# Altium schematic sheet EFR32xG22_ESL-Node_Ref-Des_Sheet2.SchDoc: LED, NTAG, EPD, XM, Batteries
size A3; Organization: Altium Limited; Revision: A02; SheetNumber: 2; SheetTotal: 2
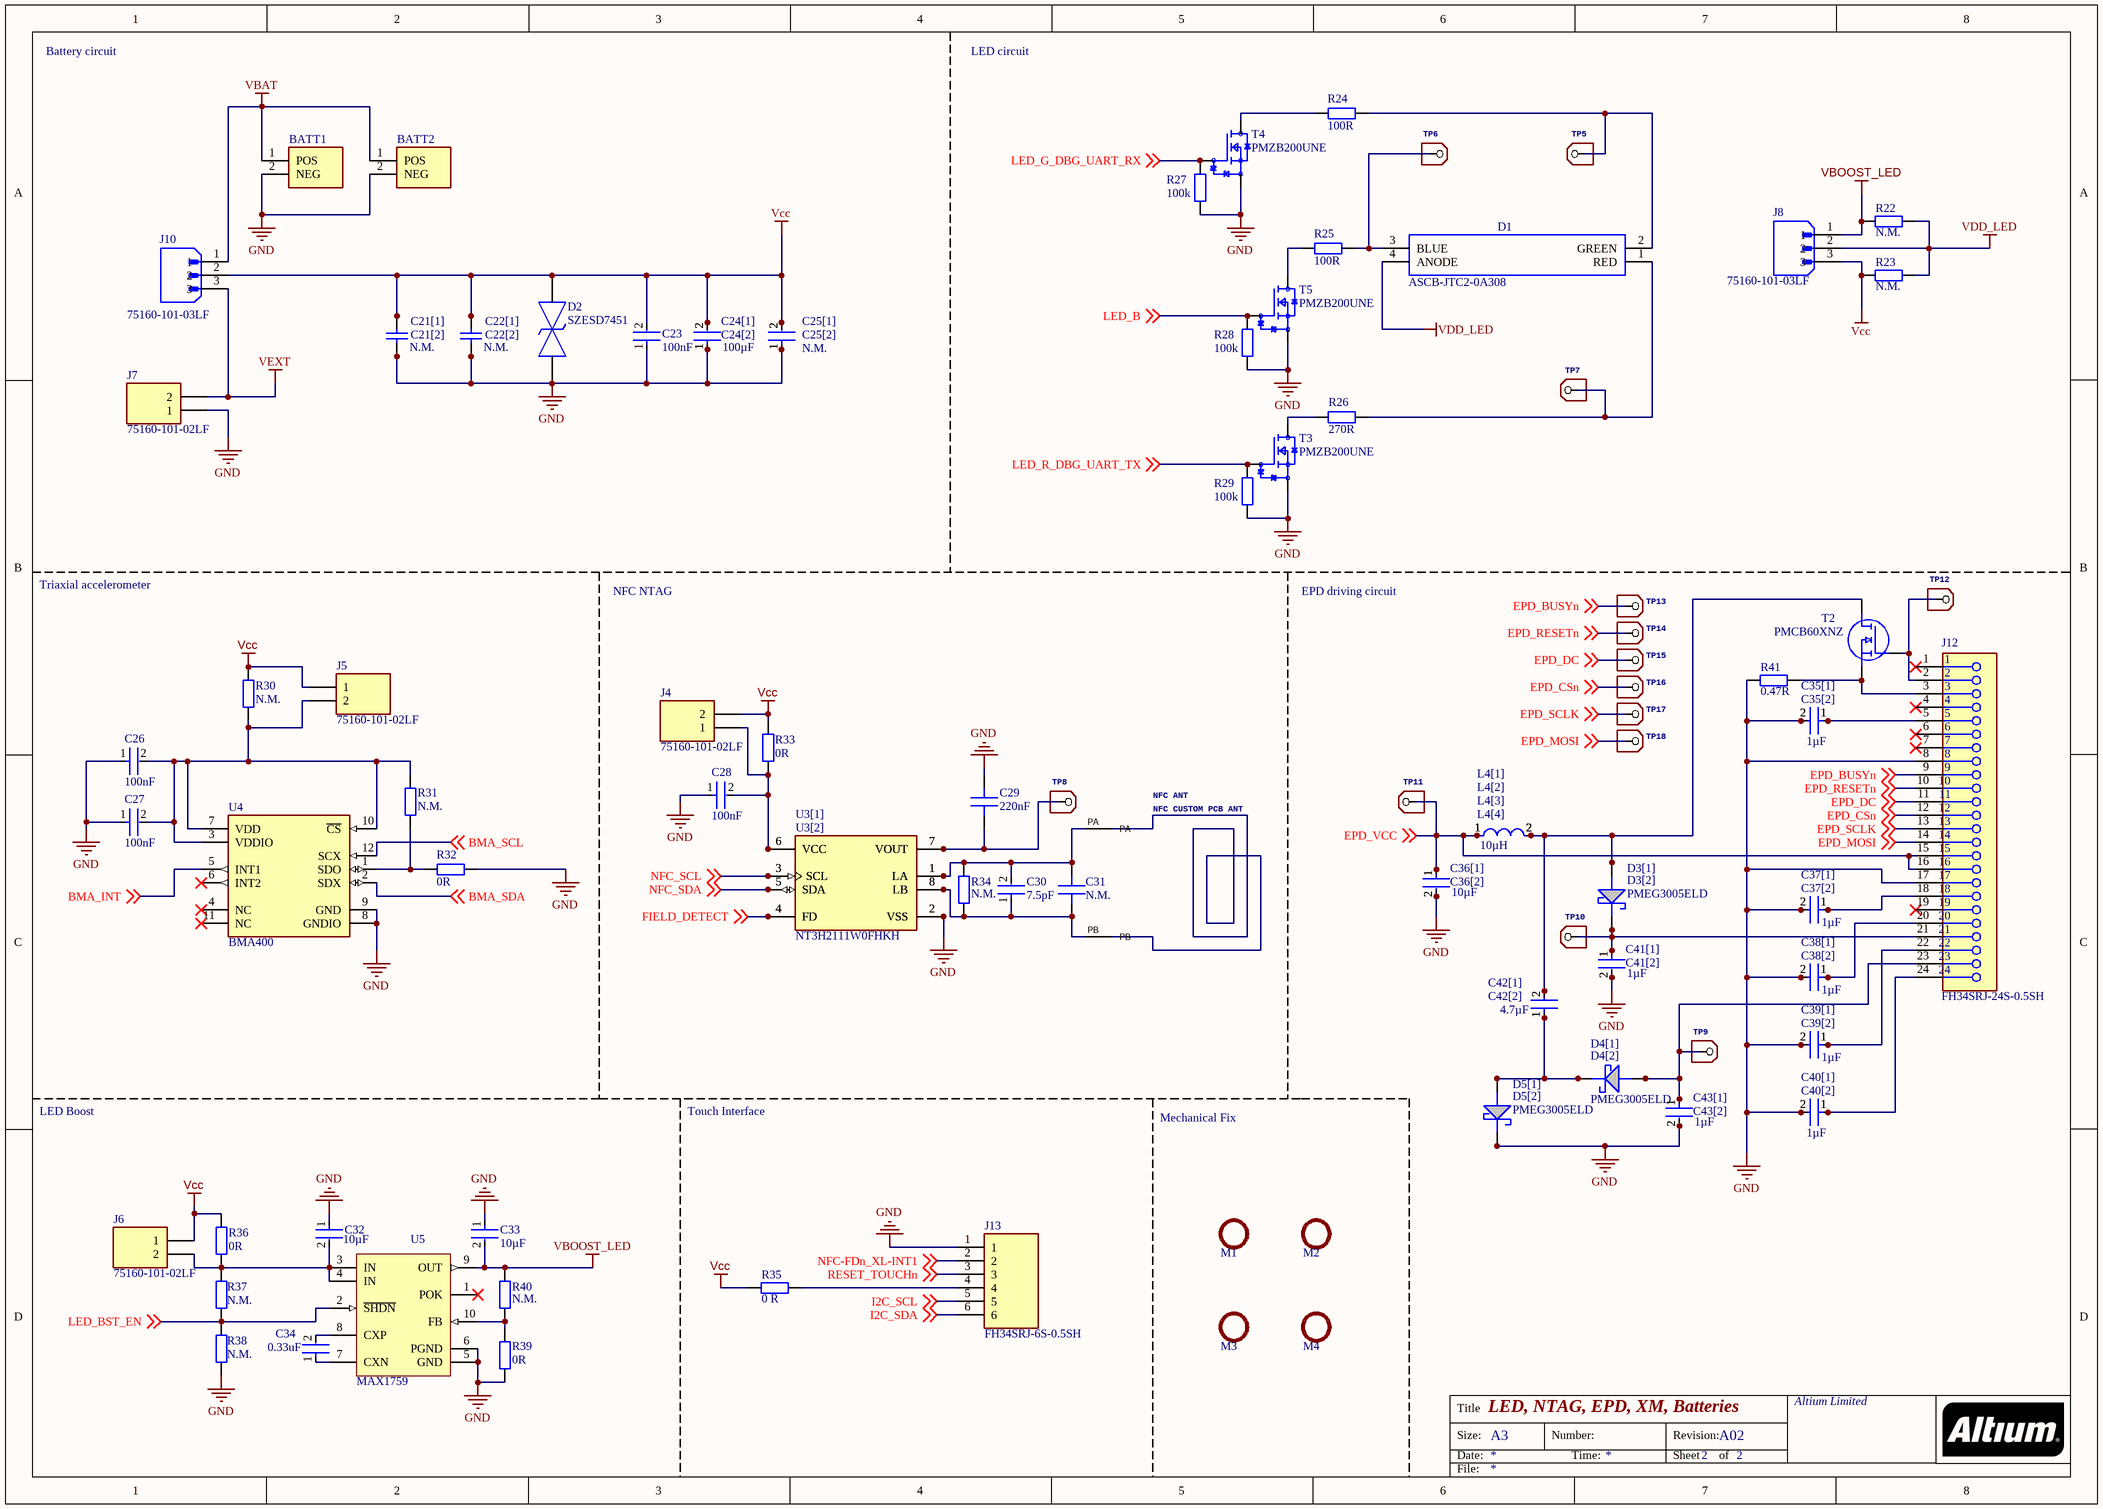
[diagram p0: EFR32xG22_ESL-Node_Ref-Des_Sheet2.SchDoc]

## Parts
BATT1  1052TR  [Battery_holder_CR2450_SMT_1052]  (value not drawn)
BATT2  1052TR  [Battery_holder_CR2450_SMT_1052]  (value not drawn)
C21[1]  N.M.  [1206]
C21[2]  N.M.  [0805]  (value not drawn)
C22[1]  N.M.  [1206]
C22[2]  N.M.  [0805]  (value not drawn)
C23  100nF  [0402]
C24[1]  100µF  [1206]
C24[2]  100µF  [0805]  (value not drawn)
C25[1]  N.M.  [1206]
C25[2]  100µF  [0805]  (value not drawn)
C26  100nF  [0402]
C27  100nF  [0402]
C28  100nF  [0201]
C29  value 220nF  [0201]  (hidden comment: CAP CER 1000PF 10V X7R 0201 10%)
C30  7.5pF  [0201]
C31  value N.M.  [0201]  (hidden comment: CAP CER 0201 C0G 1.2pF 50V 0.05pF)
C32  10µF  [0603]
C33  10µF  [0603]
C34  0.33uF  [0603]
C35[1]  1µF  [0603]
C35[2]  1µF  [0402]  (value not drawn)
C36[1]  10µF  [0603]
C36[2]  10µF  [0402]  (value not drawn)
C37[1]  1µF  [0603]
C37[2]  1µF  [0402]  (value not drawn)
C38[1]  1µF  [0603]
C38[2]  1µF  [0402]  (value not drawn)
C39[1]  1µF  [0603]
C39[2]  1µF  [0402]  (value not drawn)
C40[1]  1µF  [0603]
C40[2]  1µF  [0402]  (value not drawn)
C41[1]  1µF  [0603]
C41[2]  1µF  [0402]  (value not drawn)
C42[1]  4.7µF  [0603]
C42[2]  4.7µF  [0402]  (value not drawn)
C43[1]  1µF  [0603]
C43[2]  1µF  [0402]  (value not drawn)
D1  ASCB-JTC2-0A308  [LED_RGB_PLCC-4]
D2  SZESD7451  [SOD882_NXP]
D3[1]  PMEG3005ELD  [SOD-323]  (value not drawn)
D3[2]  PMEG3005ELD  [SOD882_FIXED]
D4[1]  PMEG3005ELD  [SOD-323]  (value not drawn)
D4[2]  PMEG3005ELD  [SOD882_FIXED]
D5[1]  PMEG3005ELD  [SOD-323]  (value not drawn)
D5[2]  PMEG3005ELD  [SOD882_FIXED]
J4  75160-101-02LF  [Jumper_HDR_2.54mm]
J5  75160-101-02LF  [Jumper_HDR_2.54mm]
J6  75160-101-02LF  [Jumper_HDR_2.54mm]
J7  75160-101-02LF  [Jumper_HDR_2.54mm]
J8  75160-101-03LF  [Jumper_HDR_2.54mm_3p]
J10  75160-101-03LF  [Jumper_HDR_2.54mm_3p]
J12  FH34SRJ-24S-0.5SH  [FPC_CONNECTOR_24_0.5MM_PITCH_BOTTOM_CONTACT_ACES_1.3MM_50530]
J13  FH34SRJ-6S-0.5SH  [FH34SRJ-6S-0.5SH]
L4[1]  10µH  [0805]  (value not drawn)
L4[2]  10µH  [0806]  (value not drawn)
L4[3]  10µH  [2520]  (value not drawn)
L4[4]  10µH  [WE-MAPI-3015]
M1  HOLE_2.2_NPL  [HOLE_2.2_NPL]  (value not drawn)
M2  HOLE_2.2_NPL  [HOLE_2.2_NPL]  (value not drawn)
M3  HOLE_2.2_NPL  [HOLE_2.2_NPL]  (value not drawn)
M4  HOLE_2.2_NPL  [HOLE_2.2_NPL]  (value not drawn)
NFC_ANT  NFC CUSTOM PCB ANT  [NFC_27X14.3_7W_WIDTH0.25MM_SPACE0.2MM_1.5UH_V1_0_NOVIASTOP]
R22  N.M.  [0603]
R23  N.M.  [0603]
R24  value 100R  [0201]  (hidden comment: RES 0201 100R 1/20W 1% 200ppm)
R25  value 100R  [0201]  (hidden comment: RES 0201 100R 1/20W 1% 200ppm)
R26  270R  [0201]
R27  100k  [0201]
R28  100k  [0201]
R29  100k  [0201]
R30  N.M.  [0603]
R31  value N.M.  [0201]  (hidden comment: RES 0201 0R)
R32  value 0R  [0201]  (hidden comment: RES 0201 0R)
R33  0R  [0603]
R34  value N.M.  [0201]  (hidden comment: RES 0201 0R)
R35  0 R  [0603]
R36  0R  [0603]
R37  N.M.  [0603]
R38  N.M.  [0603]
R39  value 0R  [0201]  (hidden comment: RES 0201 0R)
R40  value N.M.  [0201]  (hidden comment: RES 0201 0R)
R41  0.47R  [0402]
T2  PMCB60XNZ  [SOT8026]
T3  PMZB200UNE  [SOT883_B_FIXED]
T4  PMZB200UNE  [SOT883_B_FIXED]
T5  PMZB200UNE  [SOT883_B_FIXED]
TP5  TPSMDR1  [TP_RPAD1]  (value not drawn)
TP6  TPSMDR1  [TP_RPAD1]  (value not drawn)
TP7  TPSMDR1  [TP_RPAD1]  (value not drawn)
TP8  TPSMDR1  [TP_RPAD1]  (value not drawn)
TP9  TPSMDR1  [TP_RPAD1]  (value not drawn)
TP10  TPSMDR1  [TP_RPAD1]  (value not drawn)
TP11  TPSMDR1  [TP_RPAD1]  (value not drawn)
TP12  TPSMDR1  [TP_RPAD1]  (value not drawn)
TP13  TPSMDR1  [TP_RPAD1]  (value not drawn)
TP14  TPSMDR1  [TP_RPAD1]  (value not drawn)
TP15  TPSMDR1  [TP_RPAD1]  (value not drawn)
TP16  TPSMDR1  [TP_RPAD1]  (value not drawn)
TP17  TPSMDR1  [TP_RPAD1]  (value not drawn)
TP18  TPSMDR1  [TP_RPAD1]  (value not drawn)
U3[1]  NT3H2111W0FHKH  [SO8_SOIC127P600X175-8N]  (value not drawn)
U3[2]  NT3H2111W0FHKH  [XQFN-8]
U4  BMA400  [BMA400]
U5  MAX1759  [UMAX10]

## Nets
GND: BATT1.2(NEG) BATT2.2(NEG) C21[1].1 C21[2].1 C22[1].1 C22[2].1 C23.1 C24[1].1 C24[2].1 C25[1].1 C25[2].1 C26.1 C27.1 C28.1 C29.1 C32.1 C33.1 C35[1].2 C35[2].2 C36[1].2 C36[2].2 C37[1].2 C37[2].2 C38[1].2 C38[2].2 C39[1].2 C39[2].2 C40[1].2 C40[2].2 C41[1].2 C41[2].2 C43[1].2 C43[2].2 D2.A D5[1].C D5[2].C J7.1 J12.8 J12.17 J13.1 R27.1 R28.1 R29.1 R32.1 R38.1 R39.1 R41.2 T3.S T4.S T5.S U3[1].2(VSS) U3[2].2(VSS) U4.8(GNDIO) U4.9(GND) U5.5(GND) U5.6(PGND)
VBAT: BATT1.1(POS) BATT2.1(POS) J10.1
VBOOST_LED: C33.2 J8.1 R22.2 R40.2 U5.9(OUT)
Vcc: C21[1].2 C21[2].2 C22[1].2 C22[2].2 C23.2 C24[1].2 C24[2].2 C25[1].2 C25[2].2 D2.C J4.2 J5.1 J6.1 J8.3 J10.2 R23.2 R30.2 R33.2 R35.2 R36.2
VDD_LED: D1.4(ANODE) J8.2 R22.1 R23.1
VEXT: J7.2 J10.3
BMA_INT: U4.5(INT1) ; off-sheet BMA_INT
BMA_SCL: U4.12(SCX) ; off-sheet BMA_SCL
BMA_SDA: U4.2(SDX) ; off-sheet BMA_SDA
EPD_BUSYn: J12.9 TP13.P$1 ; off-sheet EPD_BUSYn
EPD_CSn: J12.12 TP16.P$1 ; off-sheet EPD_CSn
EPD_DC: J12.11 TP15.P$1 ; off-sheet EPD_DC
EPD_MOSI: J12.14 TP18.P$1 ; off-sheet EPD_MOSI
EPD_RESETn: J12.10 TP14.P$1 ; off-sheet EPD_RESETn
EPD_SCLK: J12.13 TP17.P$1 ; off-sheet EPD_SCLK
EPD_VCC: C36[1].1 C36[2].1 J12.15 J12.16 L4[1].1 L4[2].1 L4[3].1 L4[4].1 TP11.P$1 ; off-sheet EPD_VCC
FIELD_DETECT: U3[1].4(FD) U3[2].4(FD) ; off-sheet FIELD_DETECT
I2C_SCL: J13.5 ; off-sheet I2C_SCL
I2C_SDA: J13.6 ; off-sheet I2C_SDA
LED_B: R28.2 T5.G ; off-sheet LED_B
LED_BST_EN: R37.1 R38.2 U5.2(~{SHDN}) ; off-sheet LED_BST_EN
LED_G_DBG_UART_RX: R27.2 T4.G ; off-sheet LED_G_DBG_UART_RX
LED_R_DBG_UART_TX: R29.2 T3.G ; off-sheet LED_R_DBG_UART_TX
NFC-FDn_XL-INT1: J13.2 ; off-sheet NFC-FDn_XL-INT1
NFC_SCL: U3[1].3(SCL) U3[2].3(SCL) ; off-sheet NFC_SCL
NFC_SDA: U3[1].5(SDA) U3[2].5(SDA) ; off-sheet NFC_SDA
RESET_TOUCHn: J13.3 ; off-sheet RESET_TOUCHn
NetC26_2: C26.2 C27.2 J5.2 R30.1 R31.1 U4.3(VDDIO) U4.7(VDD) U4.10(~{CS})
NetC28_2: C28.2 J4.1 R33.1 U3[1].6(VCC) U3[2].6(VCC)
NetC29_2: C29.2 TP8.P$1 U3[1].7(VOUT) U3[2].7(VOUT)
NetC30_1: C30.1 C31.1 NFC_ANT.PB R34.1 U3[1].8(LB) U3[2].8(LB)
NetC30_2: C30.2 C31.2 NFC_ANT.PA R34.2 U3[1].1(LA) U3[2].1(LA)
NetC32_2: C32.2 J6.2 R36.1 R37.2 U5.3(IN) U5.4(IN)
NetC34_1: C34.1 U5.7(CXN)
NetC34_2: C34.2 U5.8(CXP)
NetC35[1]_1: C35[1].1 C35[2].1 J12.5
NetC37[1]_1: C37[1].1 C37[2].1 J12.18
NetC38[1]_1: C38[1].1 C38[2].1 J12.20
NetC39[1]_1: C39[1].1 C39[2].1 J12.22
NetC40[1]_1: C40[1].1 C40[2].1 J12.24
NetC41[1]_1: C41[1].1 C41[2].1 D3[1].C D3[2].C J12.21 TP10.P$1
NetC42[1]_1: C42[1].1 C42[2].1 D4[1].C D4[2].C D5[1].A D5[2].A
NetC42[1]_2: C42[1].2 C42[2].2 D3[1].A D3[2].A L4[1].2 L4[2].2 L4[3].2 L4[4].2 T2.D
NetC43[1]_1: C43[1].1 C43[2].1 D4[1].A D4[2].A J12.23 TP9.P$1
NetD1_1: D1.1(RED) R26.2 TP7.P$1
NetD1_2: D1.2(GREEN) R24.2 TP5.P$1
NetD1_3: D1.3(BLUE) R25.2 TP6.P$1
NetJ12_2: J12.2 T2.G TP12.P$1
NetJ12_3: J12.3 R41.1 T2.S
NetJ13_4: J13.4 R35.1
NetR24_1: R24.1 T4.D
NetR25_1: R25.1 T5.D
NetR26_1: R26.1 T3.D
NetR31_2: R31.2 R32.2 U4.1(SDO)
NetR39_2: R39.2 R40.1 U5.10(FB)

Not connected (* = marked no-connect by the designer): J12 1* 4* 6* 7* 19*; M1 0; M2 0; M3 0; M4 0; U4 4(NC)* 6(INT2)* 11(NC)*; U5 1(POK)*

## Notes on the sheet
- Battery circuit
- LED circuit
- Triaxial accelerometer
- NFC NTAG
- EPD driving circuit
- LED Boost
- Touch Interface
- Mechanical Fix
- Title
- Size:
- Date:
- A3
- Number:
- Time:
- Revision:
- Sheet
- of
- File:

## Library data of the parts
BATT1 BATT2 = 1052TR: Battery Holder _Open_ Coin, 24.5mm 1 Cell SMD _SMT_ Tab; MF: Keystone Electronics; Availability: Unavailable; SnapEDA_Link: https://www.snapeda.com/parts/1052TR/Keystone%20Electronics/view-part/3611881/?ref=snap; MP: 1052TR; Price: None; Package: None; Value: *
C21[1] C22[1] = CMP-1662-00011-2: Chip Capacitor, 100 uF, +/- 20%, 6.3 V, -55 to 85 degC, 1206 (3216 Metric), RoHS, Tape and Reel; PartNumber: GRM31CR60J107ME39L; Capacitance: 100 uF; Voltage Rating (DC): 6.3 V; Type (Capacitors): X5R; REACH SVHC: No SVHC; Height: 1.6 mm; Tolerance: 20%; Packaging: Tape and Reel; Mount: Surface Mount; PackageDescription: 2-Pin Surface Mount Device, Body 3.2 x 1.6 mm; ComponentLink1URL: http://www.murata.com/; Case\/Package: 1206; Pins: 2; ComponentLink2Description: Datasheet; PackageReference: 1206; Width: 1.6 mm; Package Quantity: 2000; Min Operating Temperature: -55 degC; Case Code (Imperial): 1206; Max Operating Temperature: 85 degC; DatasheetVersion: 09/2016; Mounting Technology: Surface Mount; Voltage Rating: 6.3 V; ComponentLink1Description: Manufacturer URL; Radiation Hardening: No; Case Code (Metric): 3216; Length: 3.2 mm; ComponentLink2URL: http://psearch.en.murata.com/capacitor/product/GRM31CR60J107ME39%23.pdf; RoHSCompliant: true
C21[2] C22[2] = CMP-1662-00011-2: Chip Capacitor, 100 uF, +/- 20%, 6.3 V, -55 to 85 degC, 1206 (3216 Metric), RoHS, Tape and Reel; PartNumber: GRM31CR60J107ME39L; Case\/Package: 1206; Capacitance: 100 uF; Voltage Rating (DC): 6.3 V; Type (Capacitors): X5R; REACH SVHC: No SVHC; Height: 1.6 mm; Tolerance: 20%; Packaging: Tape and Reel; Mount: Surface Mount; PackageDescription: 2-Pin Surface Mount Device, Body 3.2 x 1.6 mm; ComponentLink1URL: http://www.murata.com/; Pins: 2; ComponentLink2Description: Datasheet; PackageReference: 1206; Width: 1.6 mm; Package Quantity: 2000; Min Operating Temperature: -55 degC; Case Code (Imperial): 1206; Max Operating Temperature: 85 degC; DatasheetVersion: 09/2016; Mounting Technology: Surface Mount; Voltage Rating: 6.3 V; ComponentLink1Description: Manufacturer URL; Radiation Hardening: No; Case Code (Metric): 3216; Length: 3.2 mm; ComponentLink2URL: http://psearch.en.murata.com/capacitor/product/GRM31CR60J107ME39%23.pdf; RoHSCompliant: true
C23 C26 C27 = CMP-2008-03712-2: Ceramic Capacitor for Automotive 100nF ±10% 16VDC X7R 0402 Paper T/R; Voltage Rating: 16V; Height: 0.5mm; Width: 0.5mm; Packaging: Tape and Reel; Case Code (Imperial): 0402; Package Quantity: 1; Radiation Hardening: No; Voltage Rating (DC): 16V; Capacitance: 100nF; Tolerance: 10%; Thickness: 0.022inch; Max Operating Temperature: 125°C; Depth: 0.5mm; Ratings: AEC-Q200; Termination: SMD/SMT; Case Code (Metric): 1005; Min Operating Temperature: -55°C; Dielectric: X7R; Length: 1mm; Case/Package: 0402; Lead Free: Lead Free; Mount: Surface Mount
C24[1] C24[2] C25[1] C25[2] = CMP-06035-063005-1: CAP CER 100UF 6.3V X5R 1206; Tolerance: 20%; Case Code (Metric): 3216; Width: 0.063inch; Packaging: Tape and Reel; Lead Free: Lead Free; Capacitance: 100uF; Package Quantity: 1; Construction: Flat; Max Operating Temperature: 85°C; Voltage Rating (DC): 6.3V; Min Operating Temperature: -55°C; Case Code (Imperial): 1206; RoHS Compliant: Yes; Voltage: 6.3V; Mount: Surface Mount; Thickness: 0.071inch; Height: 1.6mm; Series: GRM; REACH SVHC: No SVHC; Length: 3.2mm; Voltage Rating: 6.3V; Radiation Hardening: No; Dielectric: X5R; Case/Package: 1206; Depth: 1.6mm; Termination: SMD/SMT
C28 = CMP-2010-01264-2: Chip Multilayer Ceramic Capacitors for General Purpose, 0201, 0.10uF, X5R, 15%, 10%, 10V; Mount: Surface Mount; Dielectric: X5R; Width: 0.012inch; Tolerance: 10%; Radiation Hardening: No; Voltage Rating: 10V; REACH SVHC: No SVHC; Height: 0.3mm; Max Operating Temperature: 85°C; Voltage Rating (DC): 10V; Capacitance: 100nF; Thickness: 0.013inch; Termination: SMD/SMT; Lead Free: Lead Free; Package Quantity: 1; Case/Package: 0201; Min Operating Temperature: -55°C; Weight: 6E-06oz; Length: 0.6mm; Case Code (Imperial): 0201; Depth: 0.3mm; Voltage: 10V; Packaging: Tape and Reel; Case Code (Metric): 0603
C29 = CMP-120-00038-A.01: SubCategory Tag: Ceramic; Min Operating Temp: -55°C; RoHS: Compliant; Mount: SMD; Rating: 10V; Tolerance: 10%; Package: 0201; Material: X7R; Max Operating Temp: 125°C
C30 = CMP-2010-01602-2: Chip Multilayer Ceramic Capacitors for General Purpose, 0201, 7.5pF, C0G, 30ppm/°C, 0.1pF, 50V; Mount: Surface Mount; Case/Package: 0201; Case Code (Imperial): 0201; Min Operating Temperature: -55°C; Packaging: Tape and Reel; Package Quantity: 15000; Termination: SMD/SMT; Height: 0.3mm; Width: 0.012inch; Length: 0.024inch; Voltage Rating (DC): 50V; Max Operating Temperature: 125°C; Voltage Rating: 50V; Dielectric: C0G; Capacitance: 7.5pF; Case Code (Metric): 0603; Thickness: 0.013inch
C31 = CMP-120-00031-A.02: SubCategory Tag: Ceramic; Min Operating Temp: -55°C; Package: 0201; Mount: SMD; Max Operating Temp: 125°C; Rating: 50V; RoHS: Compliant; Material: C0G; Tolerance: 0.05pF
C32 C33 = CMP-2006-02520-2: Chip Multilayer Ceramic Capacitors for General Purpose, 0603, 10uF, X5R, 15%, 20%, 25V; Tolerance: 20%; Resistor Type: Ceramic; Voltage: 25V; Max Operating Temperature: 85°C; Min Operating Temperature: -55°C; Capacitance: 10uF; Dielectric: X5R; Lead Free: Lead Free; REACH SVHC: No SVHC; Case/Package: 0603; Mount: Surface Mount; Voltage Rating (DC): 25V; Height: 0.8mm; Length: 1.6mm; Thickness: 0.031inch; Width: 0.031inch; Termination: SMD/SMT; Case Code (Imperial): 0603; Case Code (Metric): 1608; Package Quantity: 1; Packaging: Tape and Reel; Depth: 0.8mm; Voltage Rating: 25V; Weight: 0.000222oz; Number of Pins: 2
C34 = CMP-2006-02359-2: Ceramic Capacitor for Automotive 330nF  ±10% 16VDC X7R 0603 Paper T/R; Voltage Rating (DC): 16V; Package Quantity: 1; Case Code (Metric): 1608; Height: 0.8mm; Min Operating Temperature: -55°C; Length: 1.6mm; Case Code (Imperial): 0603; Max Operating Temperature: 125°C; Thickness: 0.035inch; Dielectric: X7R; Voltage Rating: 16V; Tolerance: 10%; Lead Free: Lead Free; Mount: Surface Mount; Depth: 0.8mm; Width: 0.031inch; Ratings: AEC-Q200; Packaging: Tape and Reel; Case/Package: 0603; Radiation Hardening: No; Capacitance: 330nF; Termination: SMD/SMT
C35[1] C35[2] C37[1] C37[2] C38[1] C38[2] C39[1] C39[2] C40[1] C40[2] = CMP-2006-02363-3: Ceramic Capacitor for Automotive 1uF  ±10% 25VDC X7R 0603 Paper T/R; Voltage Rating: 25V; Min Operating Temperature: -55°C; Ratings: AEC-Q200; Case Code (Imperial): 0603; Length: 1.6mm; REACH SVHC: No SVHC; Mount: Surface Mount; Width: 0.031inch; Package Quantity: 4000; Radiation Hardening: No; Lead Free: Lead Free; Dielectric: X7R; Thickness: 0.035inch; Weight: 0.000222oz; Tolerance: 10%; Case Code (Metric): 1608; Voltage Rating (DC): 25V; Case/Package: 0603; Voltage: 25V; Max Operating Temperature: 125°C; Termination: SMD/SMT; Depth: 0.8mm; Height: 0.8mm; Packaging: Tape and Reel; Capacitance: 1uF
C36[1] C36[2] C41[1] C41[2] C42[1] C42[2] C43[1] C43[2] = CMP-2000-05448-2: CAP CER 10UF 10V X5R 0603; Manufacturer Part Number: GRM188R61A106KE69D; Manufacturer: Murata; Temperature Coefficient: 15%; Material: Ceramic; Tolerance: 10%; Device Class L1: Passive Components; ComponentLink2Description: Datasheet; Height: 0.95mm; Package: GRM18-0.15; Octopart: https://octopart.com/grm188r61a106ke69d-murata-22851381; Value: 10uF; Digikey Description: CAP CER 10UF 10V X5R 0603; Temperature Range High: +85°C; Temperature Range Low: -55°C; Temperature Characteristic: X5R; Capacitance: 10uF; RoHS: TRUE; Device Class L2: Capacitors; ComponentLink2URL: https://search.murata.co.jp/Ceramy/image/img/A01X/G101/ENG/GRM188R61A106KE69-01A.pdf; Device Class L3: Ceramic Capacitors; Lead Free: Yes; Mouser Description: Multilayer Ceramic Capacitors MLCC - SMD/SMT 0603 10uF 10volts X5R + - 10%; Category: Cap; Voltage Rating: 10V; Temperature: -55°C to +85°C; Automotive: No
D1 = ASCB-JTC2-0A308: Standard LEDs - SMD 1615 Tricolor PLCC-4 LED; Manufacturer_Name: Avago Technologies; Geometry.Height: 1.2mm; Mouser Part Number: 630-ASCB-JTC2-0A308; Mouser Price/Stock: https://www.mouser.co.uk/ProductDetail/Broadcom-Avago/ASCB-JTC2-0A308?qs=TuK3vfAjtkWp7J8ieqn2Tw%3D%3D; Manufacturer_Part_Number: ASCB-JTC2-0A308; Datasheet Link: https://docs.broadcom.com/doc/ASCB-JTC2-0A308-1615-Tricolor-PLCC-4-LED-DS
D2 = ESD7551N2T5G: ESD Suppressors / TVS Diodes BI-DIRECTIONAL 5V ESD PR; Manufacturer_Name: onsemi; Geometry.Height: 0.4mm; Manufacturer_Part_Number: ESD7551N2T5G; Mouser Part Number: 863-ESD7551N2T5G; Mouser Price/Stock: https://www.mouser.co.uk/ProductDetail/onsemi/ESD7551N2T5G?qs=5aG0NVq1C4x8NutXGbtG6w%3D%3D; Arrow Part Number: ESD7551N2T5G; Arrow Price/Stock: https://www.arrow.com/en/products/esd7551n2t5g/on-semiconductor; Mouser Testing Part Number: *; Mouser Testing Price/Stock: *; Datasheet Link: http://www.onsemi.com/pub/Collateral/ESD7551-D.PDF
D3[1] D3[2] D4[1] D4[2] D5[1] D5[2] = PMEG3005ELD_315: Schottky Diodes & Rectifiers Schottky Diode; Manufacturer_Name: Nexperia; Manufacturer_Part_Number: PMEG3005ELD,315; Geometry.Height: 0.4mm; Mouser Part Number: 771-PMEG3005ELD315; Mouser Price/Stock: https://www.mouser.co.uk/ProductDetail/Nexperia/PMEG3005ELD315?qs=j56XEm5BXrSQr1dGtOQTNA%3D%3D; Arrow Part Number: PMEG3005ELD,315; Arrow Price/Stock: https://www.arrow.com/en/products/pmeg3005eld315/nexperia?region=nac; Mouser Testing Part Number: *; Mouser Testing Price/Stock: *; Datasheet Link: https://assets.nexperia.com/documents/data-sheet/PMEG3005ELD.pdf
J4-J7 = HTSW-102-28-F-S: HEADER, 2.54MM, VERTICAL THOUGH HOLE, 2 POSITION; Connector Systems:Board-to-Board; Pitch Spacing:2.54mm; No. of Rows:1Rows; No. of Contacts:2Contacts; Contact Termination Type:Through Hole; Product Range:HTSW Series; Gender:Header RoHS Compliant: Yes; MP: HTSW10228FS; MF: Samtec; Package: None; Price: None; Purchase-URL: https://pricing.snapeda.com/search/part/HTSW10228FS/?ref=eda; Availability: In Stock; Value: *; Check_prices: https://www.snapeda.com/parts/HTSW10228FS/Samtec/view-part/?ref=eda; SnapEDA_Link: https://www.snapeda.com/parts/HTSW10228FS/Samtec/view-part/?ref=snap
J8 J10 = 75160-101-03LF: BergStikÂ®, Board to Board connector, Unshrouded vertical header, through hole, single Row,3 position, 2.54mm pitch; MF: Amphenol ICC (FCI); SnapEDA_Link: https://www.snapeda.com/parts/75160-101-03LF/Amphenol+FCI/view-part/?ref=snap; Availability: In Stock; Purchase-URL: https://pricing.snapeda.com/search/part/75160-101-03LF/?ref=eda; Check_prices: https://www.snapeda.com/parts/75160-101-03LF/Amphenol+FCI/view-part/?ref=eda; Value: *; Package: None; MP: 75160-101-03LF; Price: None
J12 = CMP-11609-000022-1: CONN FPC/FFC 24POS .5MM; Number of Positions: 24; Actuator Material: Nylon; Voltage Rating: 50V; Pitch: 0.02inch; Current Rating: 500mA; Contact Plating: Gold; Packaging: Tape and Reel; RoHS Compliant: Yes; Contact Material: Bronze; Min Operating Temperature: -55°C; Max Operating Temperature: 85°C; Number of Pins: 24; Housing Material: Polymer; Termination: Solder; Mount: Surface Mount; Flammability Rating: UL94 V-0
J13 = FH34SRJ-6S-0.5SH(50): Price: None; Package: None; Availability: Unavailable; MP: FH34SRJ-6S-0.5SH(50); Value: *
L4[1] L4[2] L4[3] L4[4] = CMP-14484-000285-1: SMD Inductors 10uH ±10% 0.52A 0.65Ω 0806; Current Rating: 520mA; Test Frequency: 2.52MHz; Shielding: Unshielded; Saturation Current: 250mA; Self Resonant Frequency: 32MHz; Core Material: Ferrite; DC Resistance (DCR): 650mR; Series: CB; RoHS Compliant: Yes; Termination: SMD/SMT; Package Quantity: 2000; Radiation Hardening: No; Min Operating Temperature: -40°C; Length: 0.079inch; Tolerance: 10%; Case/Package: 0806; Packaging: Tape and Reel; Max DC Current: 520mA; Inductance Tolerance: 10%; Case Code (Imperial): 0806; Height: 1.6mm; Halogen Free: Halogen Free; Inductance: 10uH; Lead Free: Lead Free; Height - Seated (Max): 0.071inch; Case Code (Metric): 2016; Width: 1.6mm; Depth: 1.8mm; Number of Pins: 2; Resistor Type: Wirewound; Max Operating Temperature: 105°C; Mount: Surface Mount
M1-M4 = HOLE_2.2_NPL: Not Mounted: NM
NFC_ANT = NFC_ANTENNA_custom: Custom NFC Printed Antenna
R22 R23 R30 R33 R35-R38 = CMP-1012-00001-2: Manufacturer: Vishay Dale; Part Number: CRCW06030000Z0EC
R24 R25 = CMP-180-00121-A.01: Rating: 50mW; SubCategory Tag: Thick Film; Package: 0201; Mount: SMD; Min Operating Temp: -55°C; Max Operating Temp: 155°C; RoHS: Compliant; Tolerance: 1%
R26 = CMP-1010-00059-1: 240R 0.05W 5% 0201 (0603 Metric)  SMD; Value: 240.00 Ohm; Case-Metric: 0603; Technology: SMT; Tolerance: 5 %; Case-EIA: 0201; Power: 0.05 W
R27-R29 = CMP-1010-00642-1: 100K 0.05W 1% 0201 (0603 Metric)  SMD; Value: 100000.00 Ohm; Case-Metric: 0603; Technology: SMT; Power: 0.05 W; Case-EIA: 0201; Tolerance: 1 %
R31 R32 R34 R39 R40 = CMP-180-00011-A.05: SubCategory Tag: Thick Film; Rating: 50mW; Tolerance: 0%; Package: 0201; Mount: SMD; Min Operating Temp: -55°C; RoHS: Compliant; Max Operating Temp: 85°C
R41 = CMP-2002-01737-1: Part Number: RL0510S-R47-F; Manufacturer: Susumu
T2 = PMCB60XNZ: MOSFET PMCB60XN - 30 V, N-channel Trench MOSFET; Manufacturer_Name: Nexperia; Geometry.Height: 0.22mm; Mouser Part Number: 771-PMCB60XNZ; Mouser Price/Stock: https://www.mouser.co.uk/ProductDetail/Nexperia/PMCB60XNZ?qs=e8oIoAS2J1TgcVzaOfoXQA%3D%3D; Manufacturer_Part_Number: PMCB60XNZ; Datasheet Link: https://assets.nexperia.com/documents/data-sheet/PMCB60XN.pdf
T3-T5 = PMZB290UNE: N-Channel 20V 1.2A (Ta) 350mW (Ta), 5.43W (Tc) Surface Mount DFN1006B-3; MF: NXP Semiconductors; Package: None; Availability: Unavailable; SnapEDA_Link: https://www.snapeda.com/parts/PMZB290UNE/NXP%20Semiconductors/view-part/563526/?ref=snap; MP: PMZB290UNE; Value: *; Price: None
TP5-TP18 = TPSMDR1: Testpoint
U3[1] U3[2] = CMP-10079-000001-1: IC RFID TRANSP 13.56MHZ 8XQFN; Manufacturer: NXP; Max Junction Temp: +105°C; Standoff Height: 0mm; Temperature Range Low: -40°C; Package: SOT902-3; Ambient Temperature Range High: +105°C; Height: 0.5mm; Digikey Description: IC RFID TRANSP 13.56MHZ 8XQFN; ComponentLink2URL: https://www.nxp.com/docs/en/data-sheet/NT3H2111_2211.pdf; ComponentLink2Description: Datasheet; Footprint Url: https://www.nxp.com/docs/en/package-information/SOT902-3.pdf; RoHS: TRUE; Automotive: No; Category: IC; Temperature Range High: +105°C; Octopart: https://octopart.com/nt3h2111w0fhkh-nxp+semiconductors-71112033; Device Class L2: unset; Lead Free: Yes; Device Class L3: unset; Temperature: -40°C to +105°C; Ambient Temperature Range Low: -40°C; Mouser Description: NFC/RFID Tag and Transponder IC 13560kHz 1KByte 8-Pin XQFN EP T/R; Device Class L1: Integrated Circuits (ICs); Manufacturer Part Number: NT3H2111W0FHKH
U4 = CMP-191065-000001-1: ACCELEROMETER 2-16G 12LGA; Manufacturer: Bosch Sensortec; Accel Resolution: 12bits; Accel Range: 2/4/8/16g; Accel Sensitivity: 128/256/512/1024LSB/g; Min Supply Voltage: 1.2V; Operating Supply Current: 14.5uA; Accel Axis: X+Y and Z; Sensor Output: I2C,SPI; Max Supply Voltage: 3.6V; Lead Free: Yes; Manufacturer Part Number: BMA400; Ambient Temperature Range High: +85°C; Package: 0; RoHS: TRUE; Device Class L3: Accelerometers; Temperature Range High: +85°C; ComponentLink2URL: https://ae-bst.resource.bosch.com/media/_tech/media/datasheets/BST-BMA400-DS000.pdf; Octopart: https://octopart.com/bma400-bosch+sensortec-106101410; Temperature: -40°C to +85°C; Ambient Temperature Range Low: -40°C; Device Class L1: Sensors; Device Class L2: Motion Sensors; Mouser Description: BMA400 Series 3.6 V ±2g/4g/8g/16g 3 Axes Ultra Low Power Accelerometer - LGA-12; Height: 1mm; Automotive: No; Temperature Range Low: -40°C; ComponentLink2Description: Datasheet; Category: IC; Digikey Description: ACCELEROMETER 2-16G 12LGA
U5 = CMP-0246-00630-1: Buck/Boost Regulating Charge Pump, open-drain POK, 10-Pin uMAX, -40°C to +85°C, Pb-Free; PackageReference: U10+2; ComponentLink3URL: http://pdfserv.maxim-ic.com/package_dwgs/21-0061.PDF; PackageVersion: revL, 2008; Code_JEDEC: MO-187-BA; ComponentLink3Description: Package Specification; PackageDescription: 10-Pin Micro-MAX Thin Shrink Small Outline (uSOP), 3 x 3 x 0.85 mm Body, 0.5 mm Pitch, Pb-Free; ComponentLink2URL: http://datasheets.maxim-ic.com/en/ds/MAX1759.pdf; ComponentLink1Description: Manufacturer URL; ComponentLink2Description: Datasheet; DatasheetVersion: Rev 1, Jun-2000; ComponentLink1URL: http://www.maxim-ic.com